# Altium schematic sheet COMBLE.SchDoc
size A4
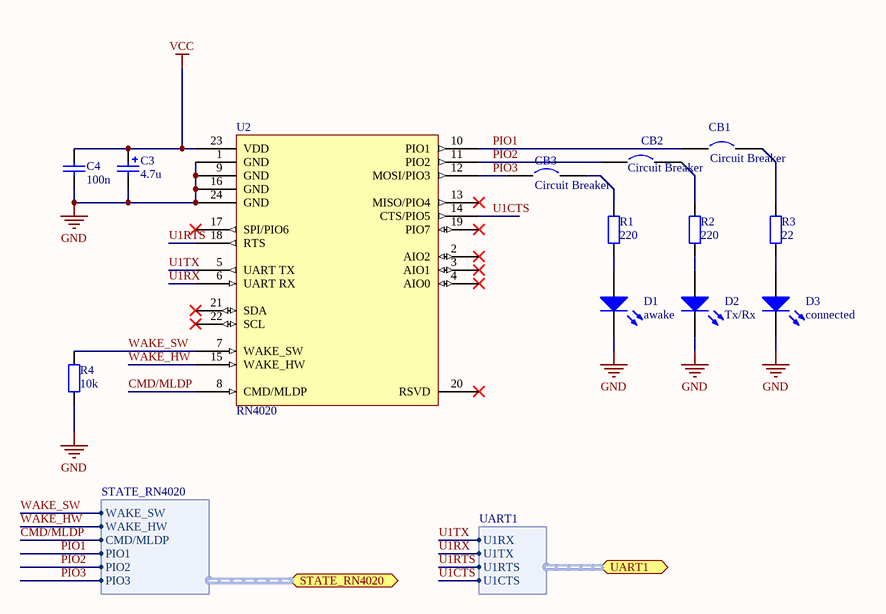
[diagram p0: COMBLE.SchDoc]

## Parts
C3  4.7u  [CAP POL 1206/3216 - 1.2MM]
C4  100n  [RES 0603/1608]
CB1  Circuit Breaker  [JUMPER PAD]
CB2  Circuit Breaker  [JUMPER PAD]
CB3  Circuit Breaker  [JUMPER PAD]
D1  awake  [LED 0603/1608 BLUE]
D2  Tx/Rx  [LED 0603/1608 BLUE]
D3  connected  [LED 0603/1608 BLUE]
R1  220  [RES 0603/1608]
R2  220  [RES 0603/1608]
R3  22  [RES 0603/1608]
R4  10k  [RES 0603/1608]
U2  RN4020  [RN4020]

## Ports
STATE_RN4020 (harness STATE_RN4020), UART1 (harness UART1)

## Harnesses
STATE_RN4020: WAKE_SW, CMD/MLDP, WAKE_HW, PIO1, PIO3, PIO2
UART1: U1RX, U1TX, U1RTS, U1CTS

## Nets
GND: C3.2 C4.2 D1.2(K) D2.2(K) D3.2(K) R4.2 U2.1(GND) U2.9(GND) U2.16(GND) U2.24(GND)
VCC: C3.1 C4.1 U2.23(VDD)
CMD/MLDP: U2.8(CMD/MLDP) ; port STATE_RN4020.CMD/MLDP
PIO1: CB1.1 U2.10(PIO1) ; port STATE_RN4020.PIO1
PIO2: CB2.1 U2.11(PIO2) ; port STATE_RN4020.PIO2
PIO3: CB3.1 U2.12(MOSI/PIO3) ; port STATE_RN4020.PIO3
U1CTS: U2.14(CTS/PIO5) ; port UART1.U1CTS
U1RTS: U2.18(RTS) ; port UART1.U1RTS
U1RX: U2.6(UART_RX) ; port UART1.U1TX
U1TX: U2.5(UART_TX) ; port UART1.U1RX
WAKE_HW: U2.15(WAKE_HW) ; port STATE_RN4020.WAKE_HW
WAKE_SW: R4.1 U2.7(WAKE_SW) ; port STATE_RN4020.WAKE_SW
NetCB1_2: CB1.2 R3.2
NetCB2_2: CB2.2 R2.2
NetCB3_2: CB3.2 R1.2
NetD1_1: D1.1(A) R1.1
NetD2_1: D2.1(A) R2.1
NetD3_1: D3.1(A) R3.1

Not connected (* = marked no-connect by the designer): U2 2(AIO2)* 3(AIO1)* 4(AIO0)* 13(MISO/PIO4)* 17(SPI/PIO6)* 19(PIO7)* 20(RSVD)* 21(SDA)* 22(SCL)*

## Library data of the parts
C3 = Cap Pol2: Condensateur tantale CMS, 4.7 µF, 10 V, Série T491, ± 10%; Fournisseur: Farnell; Fabricant: KEMET; RefFabricant: T491A475K010AT; RefFournisseur: 1457427; value: 4.7u; Footprint: 1206 [3216 Metric]
C4 = Cap: MULTICOMP  MCSH21B104K100CT  Condensateur céramique multicouche CMS, 0805 [2012 Metric], 0.1 µF, 10 V, ± 10%, X7R, Série MCSH; Fournisseur: Farnell; RefFournisseur: 1856422; Fabricant: MULTICOMP; Footprint: 0603; RefFabricant: MCSH21B104K100CT; Value: 100n
D1 D2 = LED2: LED, Ambre, CMS, 0.8mm x 1.1mm, 5 mA, 1.95 V, 590 nm; Fournisseur: Farnell; Fabrican: PANASONIC ELECTRONIC COMPONENTS; RefFabricant: LNJ437W84RA; RefFournisseur: 1908055; Footprint: 0603
D3 = LED2: LED, Bleu, CMS, 0.8mm x 1.6mm, 5 mA, 2.9 V, 470 nm; Fournisseur: Farnell; Fabrican: PANASONIC ELECTRONIC COMPONENTS; RefFabricant: LNJ926W8CRA; RefFournisseur: 1908050; Footprint: 0603
R1 R2 = Res2: YAGEO (PHYCOMP)  RC0805FR-07220RL  Résistance à puce CMS, Couche épaisse, 220 ohm, 150 V, 0805 [2012 Metric], 125 mW, ± 1%, Série RC; Fournisseur: Farnell; RefFournisseur: 9237402; Value: 220; Fabricant: YAGEO (PHYCOMP); refFabricant: RC0805FR-07220RL; Footprint: 0603
R3 = Res2: YAGEO (PHYCOMP)  RC0805FR-0722RL  Résistance à puce CMS, Couche épaisse, 22 ohm, 150 V, 0805 [2012 Metric], 125 mW, ± 1%, Série RC; Fournisseur: Farnell; RefFournisseur: 9237283; Value: 22; Fabricant: YAGEO (PHYCOMP); refFabricant: RC0805FR-0722RL; Footprint: 0603
R4 = Res2: Résistance à puce CMS, Couche épaisse, 10 kohm, 150 V, 0805; Fournisseur: Farnell; Fabricant: TE CONNECTIVITY; refFabricant: CRGH0805J10K; RefFournisseur: 2331808; Value: 10k; Footprint: 0603
U2 = RN4020: MICROCHIP  RN4020-V/RM  Module Bluetooth® Low Energy v4.1, 2.4GHz à 2.48GHz, 1 MBPS; Fournisseur: Farnell; RefFournisseur: 2442930; Fabricant: microchip; RefFabricant: RN4020-V/RM